# Altium schematic sheet PX4FMUv2.3_SCH3.SchDoc
size A4
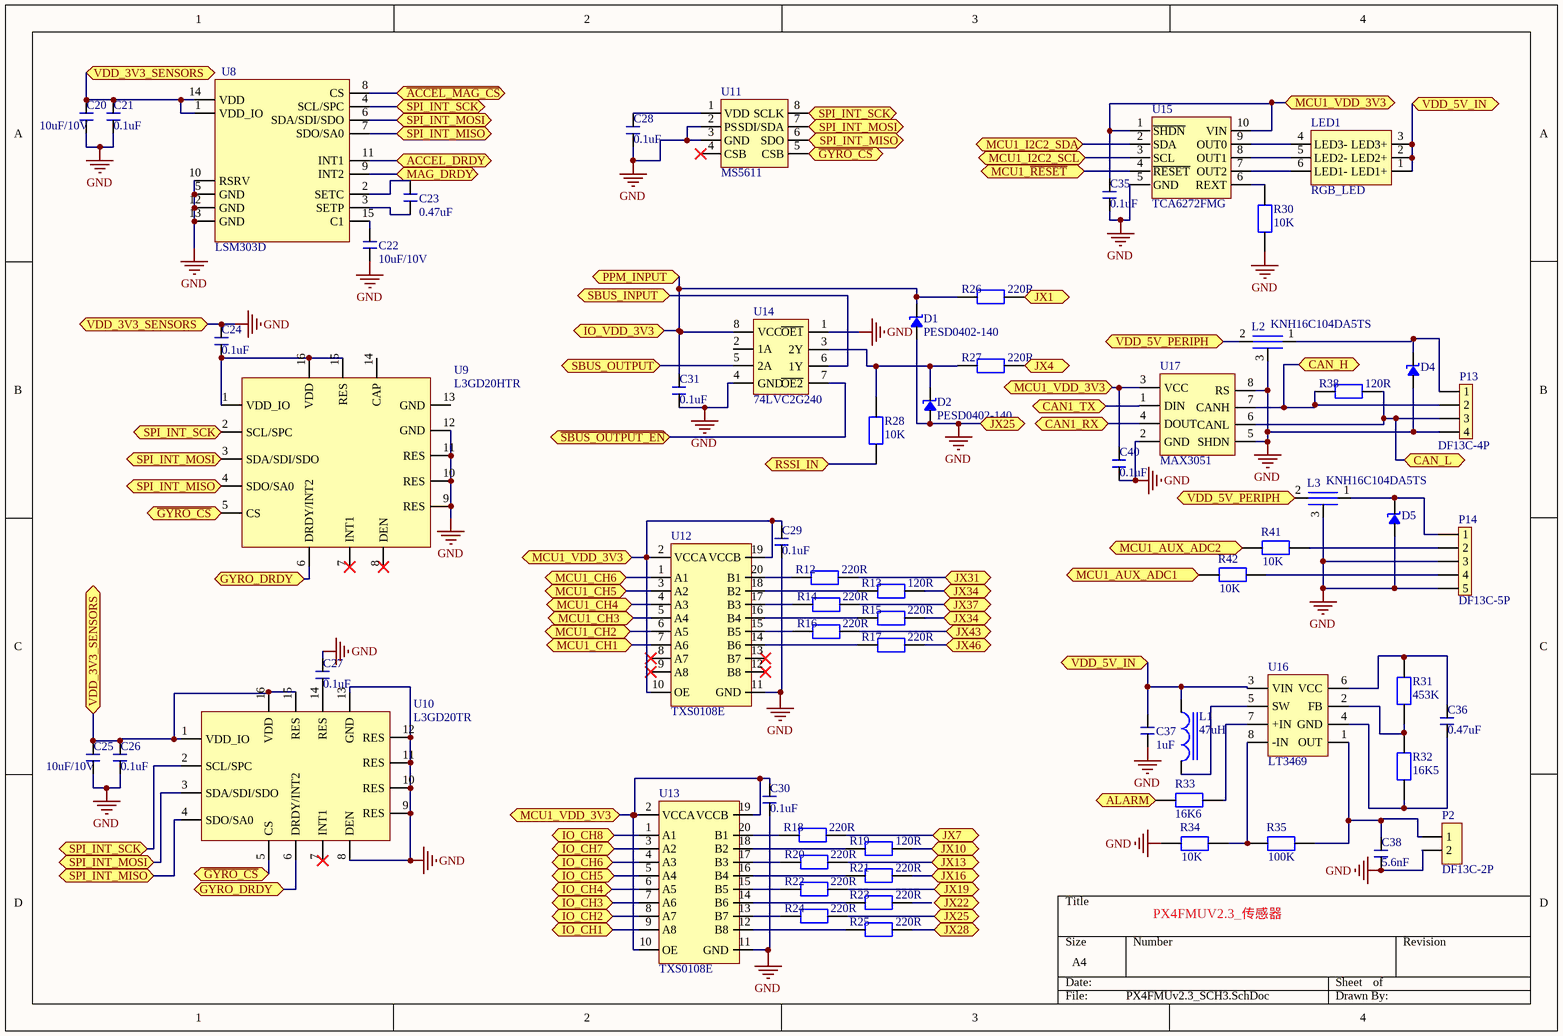
[diagram p0: PX4FMUv2.3_SCH3.SchDoc]

## Parts
C20  10uF/10V  [C 0805_L]
C21  0.1uF  [C 0402]
C22  10uF/10V  [C 0805_L]
C23  0.47uF  [C 0402]
C24  0.1uF  [C 0402]
C25  10uF/10V  [C 0805_L]
C26  0.1uF  [C 0402]
C27  0.1uF  [C 0402]
C28  0.1uF  [C 0402]
C29  0.1uF  [C 0402]
C30  0.1uF  [C 0402]
C31  0.1uF  [C 0402]
C35  0.1uF  [C 0402]
C36  0.47uF  [C 0402]
C37  1uF  [C 0603_L]
C38  5.6nF  [C 0402]
C40  0.1uF  [C 0402]
D1  PESD0402-140  [0402-TVS]
D2  PESD0402-140  [0402-TVS]
D4  PESD0402-140  [0402-TVS]  (value not drawn)
D5  PESD0402-140  [0402-TVS]  (value not drawn)
L1  47uH  [L 0805]
L2  KNH16C104DA5TS  [KYOCERA-KNH16-DA]
L3  KNH16C104DA5TS  [KYOCERA-KNH16-DA]
LED1  RGB_LED  [RGB_LED]
P2  DF13C-2P  [MX 1.25-LS-2P]
P13  DF13C-4P  [MX 1.25-LS-4P]
P14  DF13C-5P  [MX 1.25-LS-5P]
R12  220R  [0402R]
R13  120R  [0402R]
R14  220R  [0402R]
R15  220R  [0402R]
R16  220R  [0402R]
R17  220R  [0402R]
R18  220R  [0402R]
R19  120R  [0402R]
R20  220R  [0402R]
R21  220R  [0402R]
R22  220R  [0402R]
R23  220R  [0402R]
R24  220R  [0402R]
R25  220R  [0402R]
R26  220R  [0402R]
R27  220R  [0402R]
R28  10K  [0402R]
R30  10K  [0402R]
R31  453K  [0402R]
R32  16K5  [0402R]
R33  16K6  [0402R]
R34  10K  [0402R]
R35  100K  [0402R]
R38  120R  [0402R]
R41  10K  [0402R]
R42  10K  [0402R]
U8  LSM303D  [LGA_16L]
U9  L3GD20HTR  [LGA_16L]
U10  L3GD20TR  [LGA-16]
U11  MS5611  [MS5611]
U12  TXS0108E  [PQFN50P450X350X100_HS-21N]
U13  TXS0108E  [PQFN50P450X350X100_HS-21N]
U14  74LVC2G240  [TSSOP-8]
U15  TCA6272FMG  [SON10]
U16  LT3469  [SOT23-8]
U17  MAX3051  [SOT23-8]

## Ports
ACCEL_DRDY (bidir), ALARM (bidir), CAN1_RX (bidir), CAN1_TX (bidir), CAN_H (bidir), CAN_L (bidir), GYRO_DRDY (bidir), IO_CH1 (bidir), IO_CH2 (bidir), IO_CH3 (bidir), IO_CH4 (bidir), IO_CH5 (bidir), IO_CH6 (bidir), IO_CH7 (bidir), IO_CH8 (bidir), IO_VDD_3V3 (bidir), JX1 (bidir), JX4 (bidir), JX7 (bidir), JX10 (bidir), JX13 (bidir), JX16 (bidir), JX19 (bidir), JX22 (bidir), JX25 (bidir), JX28 (bidir), JX31 (bidir), JX34 (bidir), JX37 (bidir), JX43 (bidir), JX46 (bidir), MAG_DRDY (bidir), MCU1_AUX_ADC1 (bidir), MCU1_AUX_ADC2 (bidir), MCU1_CH1 (bidir), MCU1_CH2 (bidir), MCU1_CH3 (bidir), MCU1_CH4 (bidir), MCU1_CH5 (bidir), MCU1_CH6 (bidir), MCU1_I2C2_SCL (bidir), MCU1_I2C2_SDA (bidir), MCU1_VDD_3V3 (bidir), MCU1_~{RESET} (bidir), PPM_INPUT (bidir), RSSI_IN (bidir), SBUS_INPUT (bidir), SBUS_OUTPUT (bidir), SPI_INT_MISO (bidir), SPI_INT_MOSI (bidir), SPI_INT_SCK (bidir), VDD_3V3_SENSORS (bidir), VDD_5V_IN (bidir), VDD_5V_PERIPH (bidir), ~{ACCEL_MAG_CS} (bidir), ~{GYRO_CS} (bidir), ~{SBUS_OUTPUT_EN} (bidir)

## Nets
GND: C20.1 C20.2 C21.1 C21.2 C22.2 C24.1 C25.1 C25.2 C26.1 C26.2 C27.1 C28.2 C29.2 C30.2 C31.2 C35.2 C37.2 C38.2 C40.2 D1.1 D2.1 D4.1 D5.1 L2.3 L3.3 P2.2 P13.4 P14.3 P14.5 R24.2 R30.1 R34.2 U8.1(VDD_IO) U8.5(GND) U8.10(RSRV) U8.12(GND) U8.13(GND) U8.14(VDD) U9.9(RES) U9.10(RES) U9.11(RES) U9.12(GND) U10.1(VDD_IO) U10.8(DEN) U10.9(RES) U10.10(RES) U10.11(RES) U10.12(RES) U10.13(GND) U10.15(RES) U10.16(VDD) U11.2(PS) U11.3(GND) U12.11(GND) U13.11(GND) U14.1(~{OE1}) U14.4(GND) U15.5(GND) U17.2(GND) U17.5(SHDN) U17.8(RS) ; port VDD_3V3_SENSORS, port JX25
~{ACCEL_MAG_CS}: U8.8(CS) ; port ~{ACCEL_MAG_CS}
ACCEL_DRDY: U8.11(INT1) ; port ACCEL_DRDY
ALARM: R33.2 ; port ALARM
CAN1_RX: U17.4(DOUT) ; port CAN1_RX
CAN1_TX: U17.1(DIN) ; port CAN1_TX
CAN_H: P13.2 R38.1 U17.7(CANH) ; port CAN_H
CAN_L: P13.3 R38.2 U17.6(CANL) ; port CAN_L
~{GYRO_CS}: U9.5(CS) U10.5(CS) U11.5(CSB) ; port ~{GYRO_CS}
GYRO_DRDY: U9.6(DRDY/INT2) U10.6(DRDY/INT2) ; port GYRO_DRDY
IO_CH1: U13.9(A8) ; port IO_CH1
IO_CH2: U13.8(A7) ; port IO_CH2
IO_CH3: U13.7(A6) ; port IO_CH3
IO_CH4: U13.6(A5) ; port IO_CH4
IO_CH5: U13.5(A4) ; port IO_CH5
IO_CH6: U13.4(A3) ; port IO_CH6
IO_CH7: U13.3(A2) ; port IO_CH7
IO_CH8: U13.1(A1) ; port IO_CH8
IO_VDD_3V3: C31.1 D1.2 R26.1 U14.8(VCC) ; port PPM_INPUT, port IO_VDD_3V3
JX1: R26.2 ; port JX1
JX4: R27.2 ; port JX4
JX7: R18.2 ; port JX7
JX10: R19.2 ; port JX10
JX13: R20.2 ; port JX13
JX16: R21.2 ; port JX16
JX19: R22.2 ; port JX19
JX28: R25.2 ; port JX28
JX31: R12.2 ; port JX31
JX34: R13.2 R15.2 ; port JX34
JX37: R14.2 ; port JX37
JX43: R16.2 ; port JX43
JX46: R17.2 ; port JX46
MAG_DRDY: U8.9(INT2) ; port MAG_DRDY
MCU1_AUX_ADC1: R42.2 ; port MCU1_AUX_ADC1
MCU1_AUX_ADC2: R41.2 ; port MCU1_AUX_ADC2
MCU1_CH1: U12.7(A6) ; port MCU1_CH1
MCU1_CH2: U12.6(A5) ; port MCU1_CH2
MCU1_CH3: U12.5(A4) ; port MCU1_CH3
MCU1_CH4: U12.4(A3) ; port MCU1_CH4
MCU1_CH5: U12.3(A2) ; port MCU1_CH5
MCU1_CH6: U12.1(A1) ; port MCU1_CH6
MCU1_I2C2_SCL: U15.3(SCL) ; port MCU1_I2C2_SCL
MCU1_I2C2_SDA: U15.2(SDA) ; port MCU1_I2C2_SDA
MCU1_~{RESET}: U15.4(~{RESET}) ; port MCU1_~{RESET}
MCU1_VDD_3V3: C29.1 C30.1 C35.1 C40.1 U12.2(VCCA) U12.10(OE) U12.19(VCCB) U13.2(VCCA) U13.10(OE) U13.19(VCCB) U15.1(~{SHDN}) U15.10(VIN) U17.3(VCC) ; port MCU1_VDD_3V3
RSSI_IN: R28.1 ; port RSSI_IN
~{SBUS_OUTPUT_EN}: U14.7(~{OE2}) ; port ~{SBUS_OUTPUT_EN}
SBUS_INPUT: U14.6(1Y) ; port SBUS_INPUT
SBUS_OUTPUT: U14.5(2A) ; port SBUS_OUTPUT
SPI_INT_MISO: U8.7(SDO/SA0) U9.4(SDO/SA0) U10.4(SDO/SA0) U11.6(SDO) ; port SPI_INT_MISO
SPI_INT_MOSI: U8.6(SDA/SDI/SDO) U9.3(SDA/SDI/SDO) U10.3(SDA/SDI/SDO) U11.7(SDI/SDA) ; port SPI_INT_MOSI
SPI_INT_SCK: U8.4(SCL/SPC) U9.2(SCL/SPC) U10.2(SCL/SPC) U11.8(SCLK) ; port SPI_INT_SCK
VDD_5V_IN: C37.1 L1.2 LED1.1(LED1+) LED1.2(LED2+) LED1.3(LED3+) U16.3(VIN) ; port VDD_5V_IN
VDD_5V_PERIPH: L2.2 L3.2 ; port VDD_5V_PERIPH
NetC22_1: C22.1 U8.15(C1)
NetC23_1: C23.1 U8.2(SETC)
NetC23_2: C23.2 U8.3(SETP)
NetC24_2: C24.2 U9.1(VDD_IO) U9.15(RES) U9.16(VDD)
NetC27_2: C27.2 U10.14(RES)
NetC28_1: C28.1 U11.1(VDD)
NetC36_1: C36.1 R31.2 U16.6(VCC)
NetC36_2: C36.2 R32.1 U16.4(GND)
NetC38_1: C38.1 P2.1 R35.1 U16.1(OUT)
NetD2_2: D2.2 R27.1 R28.2 U14.3(2Y)
NetD4_2: D4.2 L2.1 P13.1
NetD5_2: D5.2 L3.1 P14.1
NetL1_1: L1.1 U16.5(SW)
NetLED1_4: LED1.4(LED3-) U15.9(OUT0)
NetLED1_5: LED1.5(LED2-) U15.8(OUT1)
NetLED1_6: LED1.6(LED1-) U15.7(OUT2)
NetP14_2: P14.2 R41.1
NetP14_4: P14.4 R42.1
NetR12_1: R12.1 U12.20(B1)
NetR13_1: R13.1 U12.18(B2)
NetR14_1: R14.1 U12.17(B3)
NetR15_1: R15.1 U12.16(B4)
NetR16_1: R16.1 U12.15(B5)
NetR17_1: R17.1 U12.14(B6)
NetR18_1: R18.1 U13.20(B1)
NetR19_1: R19.1 U13.18(B2)
NetR20_1: R20.1 U13.17(B3)
NetR21_1: R21.1 U13.16(B4)
NetR22_1: R22.1 U13.15(B5)
NetR23_1: R23.1 U13.14(B6)
NetR24_1: R24.1 U13.13(B7)
NetR25_1: R25.1 U13.12(B8)
NetR30_2: R30.2 U15.6(REXT)
NetR31_1: R31.1 R32.2 U16.2(FB)
NetR33_1: R33.1 U16.7(+IN)
NetR34_1: R34.1 R35.2 U16.8(-IN)

Not connected (* = marked no-connect by the designer): R23 2; U9 7(INT1)* 8(DEN)* 13(GND) 14(CAP); U10 7(INT1)*; U11 4(CSB)*; U12 8(A7)* 9(A8)* 12(B8)* 13(B7)*; U14 2(1A)

## Notes on the sheet
- PX4FMUV2.3_传感器

## Library data of the parts
C20 C22 C25 = CAP_0805
C21 C23 C24 C26-C31 C35 C36 C38 C40 = CAP_0402
C37 = CAP_0603
L1 = L_0805
R12-R28 R30-R35 R38 R41 R42 = Res_0402